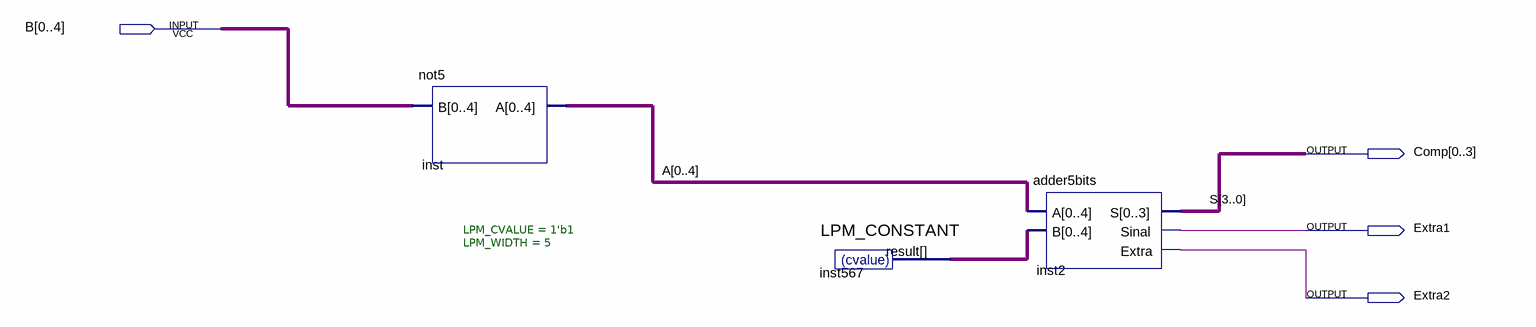
[diagram p0: schematic sheet]
// Quartus schematic compa2.bdf as structural Verilog: 3 symbols, 4 pins
module compa2 (
  input  [0:4] B,
  output [0:3] Comp,
  output Extra1,
  output Extra2
);

  wire [4:0] A, inst567_result;

  not5 inst (.B(B), .A({A[0], A[1], A[2], A[3], A[4]}));
  LPM_CONSTANT #(.LPM_CVALUE(1'b1), .LPM_WIDTH(5)) inst567 (.result(inst567_result));
  adder5bits inst2 (.A({A[0], A[1], A[2], A[3], A[4]}), .B(inst567_result), .S(Comp), .Sinal(Extra1), .Extra(Extra2));

  // Other names for the same wires on the sheet: S[3:0] = Comp
endmodule
